# EAGLE design akagi (EAGLE 6.5.0)
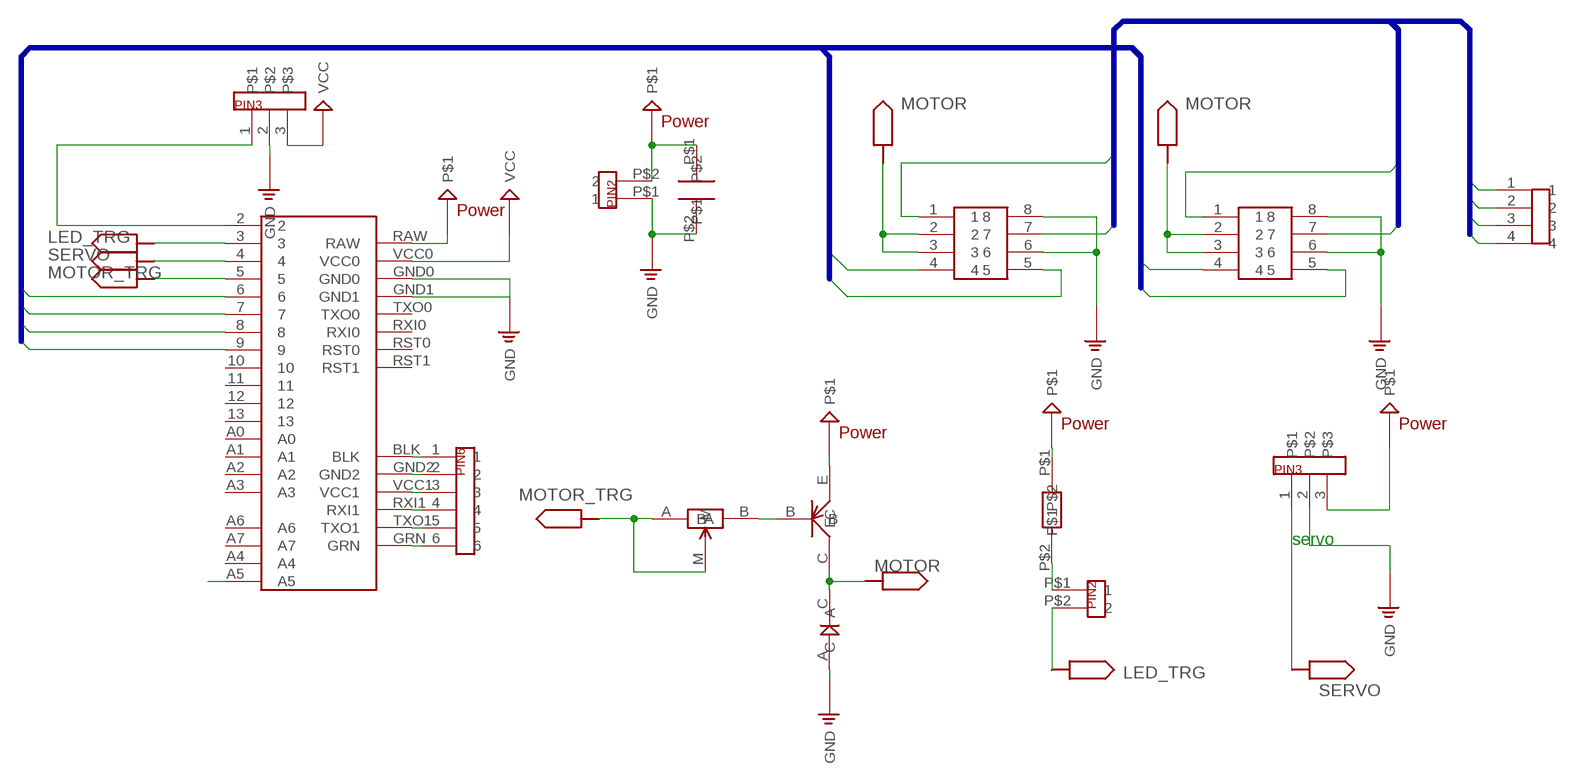
[diagram p0: schematic, sheet 1]

## Parts
U$1  ARDUINO_PRO_MINI  [ARDUINO_PRO_MINI]
U$2  PIN3  [PIN3]
U$4  PIN2  [PIN2]
U$5  PIN_4_1  [PIN_4_1]
U$7  TRANSISTOR_PNP  [TRANSISTOR]
U$8  CAPACITOR  [CAPACITOR]
U$9  PIN3  [PIN3]
U$14  REGISTER  [REGISTER]
U$15  RESISTOR_VALIABLE  [RESISTOR_VALIABLE]
U$17  DIORDE  [DIORDE]
U$21  DIP8  [DIP8]
U$26  DIP8  [DIP8]
U$34  PIN6  [PIN6]
U$37  PIN2  [PIN2]

## Nets
B$0: U$5.1 U$21.1
B$1: U$5.2 U$21.7
B$2: U$5.3 U$26.1
B$3: U$5.4 U$26.7
GND: U$1.GND0 U$1.GND1 U$2.2 U$4.P$1 U$8.P$2 U$9.2 U$17.A U$21.6 U$21.8 U$26.6 U$26.8
LED_TRG: U$1.3 U$37.P$2
MOTER_SIGNAL0: U$1.6 U$21.4
MOTER_SIGNAL1: U$1.7 U$21.5
MOTER_SIGNAL2: U$1.8 U$26.4
MOTER_SIGNAL3: U$1.9 U$26.5
MOTOR: U$7.C U$17.C U$21.2 U$21.3 U$26.2 U$26.3
MOTOR_TRG: U$1.5 U$15.A U$15.M
N$1: U$1.2 U$9.1
N$2: U$14.P$2 U$37.P$1
N$14: U$1.A5
N$15: U$1.GRN U$34.6
N$16: U$1.TXO1 U$34.5
N$17: U$1.RXI1 U$34.4
N$18: U$1.VCC1 U$34.3
N$19: U$1.GND2 U$34.2
N$25: U$1.BLK U$34.1
N$26: U$7.B U$15.B
P$1: U$1.RAW U$2.3 U$4.P$2 U$7.E U$8.P$1 U$14.P$1 ; supply symbol labelled POWER
SERVO: U$1.4 U$2.1
VCC: U$1.VCC0 U$9.3
Unconnected: U$1.10 U$1.11 U$1.12 U$1.13 U$1.A0 U$1.A1 U$1.A2 U$1.A3 U$1.A4 U$1.A6 U$1.A7 U$1.RST0 U$1.RST1 U$1.RXI0 U$1.TXO0

## Buses
B$[0..3]
MOTER_SIGNAL[0..3]

## Notes on the sheet
- servo

## Library data of the parts
U$1 = mylib:ARDUINO_PRO_MINI
U$2 U$9 = mylib:PIN3
U$4 U$37 = mylib:PIN2
U$5 = mylib:PIN_4_1
U$7 = mylib:TRANSISTOR_PNP
U$8 = mylib:CAPACITOR
U$14 = mylib:REGISTER
U$15 = mylib:RESISTOR_VALIABLE
U$17 = mylib:DIORDE
U$21 U$26 = mylib:DIP8
U$34 = mylib:PIN6

## Board
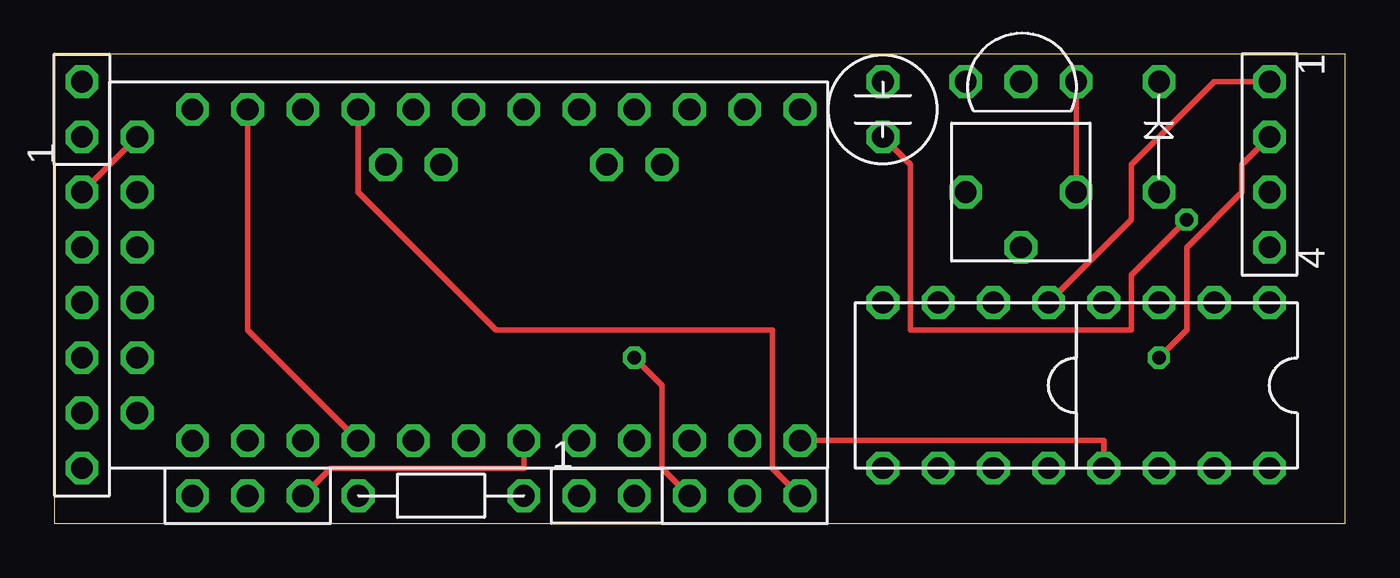
[diagram p1: board, top side]
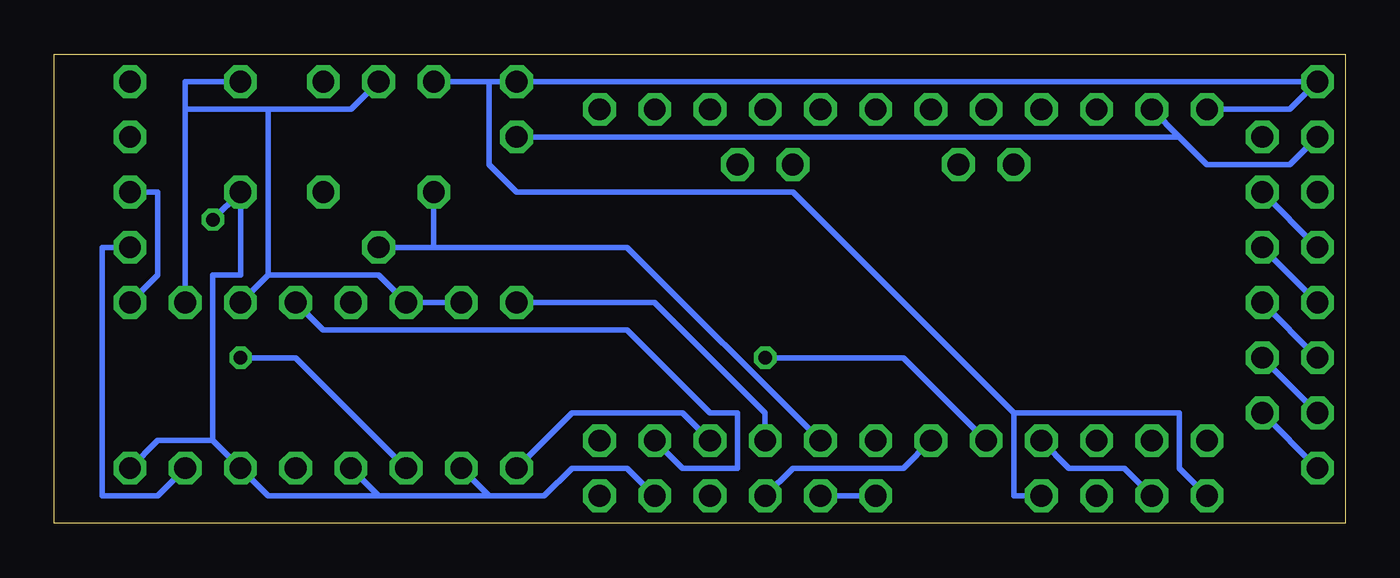
[diagram p2: board, bottom side, seen from below]

Size 59.36 x 21.58 mm. Coordinates in mm from the lower left corner, seen from the top.
Outline: 0,0 59.36,0 59.36,21.58 0,21.58 0,0
Copper layers (1*16): Top 0.035mm / dielectric 1.5mm / Bottom 0.035mm
Design rules "default": minimum track width 10mil, minimum drill 24mil, track to track 8mil, track to pad 8mil, pad to pad 8mil, via to via 8mil, smd to smd 8mil, copper to edge 40mil, drill to drill 8mil, minimum pad ring 10mil, minimum via ring 8mil, stop-mask expansion 4mil, vias tented up to drill 0mil, thermal gap 10mil

### Footprints (pad centres in the part's own frame; a part is rotated, then mirrored left to right if it is on the bottom)
ARDUINO_PRO_MINI = drill 1 octagon: 2 -7.62,3.81; 3 -7.62,1.27; 4 -7.62,-1.27; 5 -7.62,-3.81; 6 -7.62,-6.35; 7 -7.62,-8.89; 8 -7.62,-11.43; 9 -7.62,-13.97; 10 7.62,-13.97; 11 7.62,-11.43; 12 7.62,-8.89; 13 7.62,-6.35; A0 7.62,-3.81; A1 7.62,-1.27; A2 7.62,1.27; A3 7.62,3.81; A4 5.08,2.54; A5 5.08,5.08; A6 5.08,-7.62; A7 5.08,-5.08; BLK -6.35,16.51; GND0 -7.62,6.35; GND1 7.62,11.43; GND2 -3.81,16.51; GRN 6.35,16.51; RAW 7.62,13.97; RST0 -7.62,8.89; RST1 7.62,8.89; RXI0 -7.62,11.43; RXI1 1.27,16.51; TXO0 -7.62,13.97; TXO1 3.81,16.51; VCC0 7.62,6.35; VCC1 -1.27,16.51
PIN3 = drill 1 octagon: 1 -2.54,0; 2 0,0; 3 2.54,0
PIN2 = drill 1 octagon: P$1 -1.27,0; P$2 1.27,0
PIN_4_1 = drill 1 octagon: 1 -3.81,0; 2 -1.27,0; 3 1.27,0; 4 3.81,0
TRANSISTOR = drill 1 octagon: B 2.54,0; C 0,0; E -2.54,0
CAPACITOR = drill 1 octagon: P$1 1.27,0; P$2 -1.27,0
REGISTER = drill 1 octagon: P$1 -3.81,0; P$2 3.81,0
RESISTOR_VALIABLE = drill 1 octagon: A -2.54,0; B 2.54,0; M 0,-2.54
DIORDE = drill 1 octagon: A -2.54,0; C 2.54,0
DIP8 = drill 1 octagon: 1 -3.81,3.81; 2 -3.81,1.27; 3 -3.81,-1.27; 4 -3.81,-3.81; 5 3.81,-3.81; 6 3.81,-1.27; 7 3.81,1.27; 8 3.81,3.81
PIN6 = drill 1 octagon: 1 -6.35,0; 2 -3.81,0; 3 -1.27,0; 4 1.27,0; 5 3.81,0; 6 6.35,0

### Placement (x,y rotation side)
U$1  20.32,11.43 90 top
U$2  8.89,1.27 180 top
U$4  1.27,19.05 90 top
U$5  55.88,16.51 270 top
U$7  44.45,20.32 0 top
U$8  38.1,19.05 90 top
U$9  31.75,1.27 0 top
U$14  17.78,1.27 0 top
U$15  44.45,15.24 0 top
U$17  50.8,17.78 90 top
U$21  41.91,6.35 270 top
U$26  52.07,6.35 270 top
U$34  1.27,8.89 90 top
U$37  25.4,1.27 0 top

### Tracks (layer width: path | path; a pad name or v marks a point on that pad's centre or on a via)
B$0
  Top 0.254: U$21.1 49.53,13.97 49.53,16.51 53.34,20.32 U$5.1
B$1  (via drill 0.61)
  Top 0.254: v50.8,7.62 52.07,8.89 52.07,12.7 54.61,15.24 54.61,16.51 U$5.2
  Bottom 0.254: U$21.7 48.26,7.62 v50.8,7.62
B$2
  Bottom 0.254: U$26.1 54.61,11.43 54.61,15.24 U$5.3
B$3
  Bottom 0.254: U$26.7 54.61,1.27 57.15,1.27 57.15,12.7 U$5.4
GND  (via drill 0.61)
  Top 0.254: U$1.GND0 8.89,8.89 U$1.GND1 | v52.07,13.97 49.53,11.43 49.53,8.89 39.37,8.89 39.37,16.51 U$8.P$2
  Bottom 0.254: U$9.2 33.02,2.54 35.56,2.54 36.83,1.27 39.37,1.27 | U$21.6 39.37,1.27 | 44.45,1.27 U$21.8 | 39.37,1.27 44.45,1.27 | 44.45,1.27 49.53,1.27 U$26.6 52.07,3.81 | U$26.8 54.61,3.81 52.07,3.81 | 52.07,3.81 52.07,11.43 50.8,11.43 U$17.A v52.07,13.97 | U$2.2 10.16,2.54 12.7,2.54 U$1.GND0 | U$4.P$1 2.54,16.51 6.35,16.51 7.62,17.78 | U$1.GND1 7.62,17.78 | 7.62,17.78 U$8.P$2
LED_TRG
  Bottom 0.254: U$1.3 20.32,2.54 25.4,2.54 U$37.P$2
MOTER_SIGNAL0
  Bottom 0.254: U$1.6 26.67,5.08 31.75,10.16 U$21.4
MOTER_SIGNAL1
  Bottom 0.254: U$1.7 30.48,5.08 35.56,5.08 U$21.5
MOTER_SIGNAL2
  Bottom 0.254: U$1.8 30.48,2.54 27.94,2.54 27.94,5.08 29.21,5.08 33.02,8.89 46.99,8.89 U$26.4
MOTER_SIGNAL3
  Top 0.254: U$1.9 48.26,3.81 U$26.5
MOTOR
  Bottom 0.254: U$21.3 U$21.2 44.45,11.43 49.53,11.43 | 49.53,11.43 U$26.3 | 53.34,19.05 53.34,20.32 U$17.C | 53.34,19.05 U$26.2 | U$7.C 45.72,19.05 49.53,19.05 | 53.34,19.05 49.53,19.05 | 49.53,19.05 49.53,11.43
MOTOR_TRG
  Bottom 0.254: U$1.5 33.02,12.7 41.91,12.7 | U$15.M 41.91,12.7 | 41.91,12.7 U$15.A
N$1  (via drill 0.61)
  Top 0.254: v26.67,7.62 27.94,6.35 27.94,2.54 U$9.1
  Bottom 0.254: U$1.2 20.32,7.62 v26.67,7.62
N$2
  Bottom 0.254: U$37.P$1 U$14.P$2
N$15
  Top 0.254: U$1.GRN U$34.6
N$16
  Bottom 0.254: U$1.TXO1 U$34.5
N$17
  Bottom 0.254: U$1.RXI1 U$34.4
N$18
  Bottom 0.254: U$1.VCC1 U$34.3
N$19
  Bottom 0.254: U$1.GND2 U$34.2
N$25
  Bottom 0.254: U$1.BLK U$34.1
N$26
  Top 0.254: U$7.B U$15.B
P$1
  Bottom 0.254: U$2.3 7.62,2.54 7.62,5.08 15.24,5.08 | 15.24,5.08 15.24,1.27 U$14.P$1 | U$7.E 39.37,20.32 | 39.37,20.32 U$8.P$1 U$4.P$2 2.54,19.05 U$1.RAW | 15.24,5.08 25.4,15.24 38.1,15.24 39.37,16.51 39.37,20.32
SERVO
  Top 0.254: U$2.1 12.7,2.54 21.59,2.54 U$1.4
VCC
  Top 0.254: U$1.VCC0 13.97,15.24 20.32,8.89 33.02,8.89 33.02,2.54 U$9.3